# EAGLE design blink1_trinket0 (EAGLE 9.4.2)
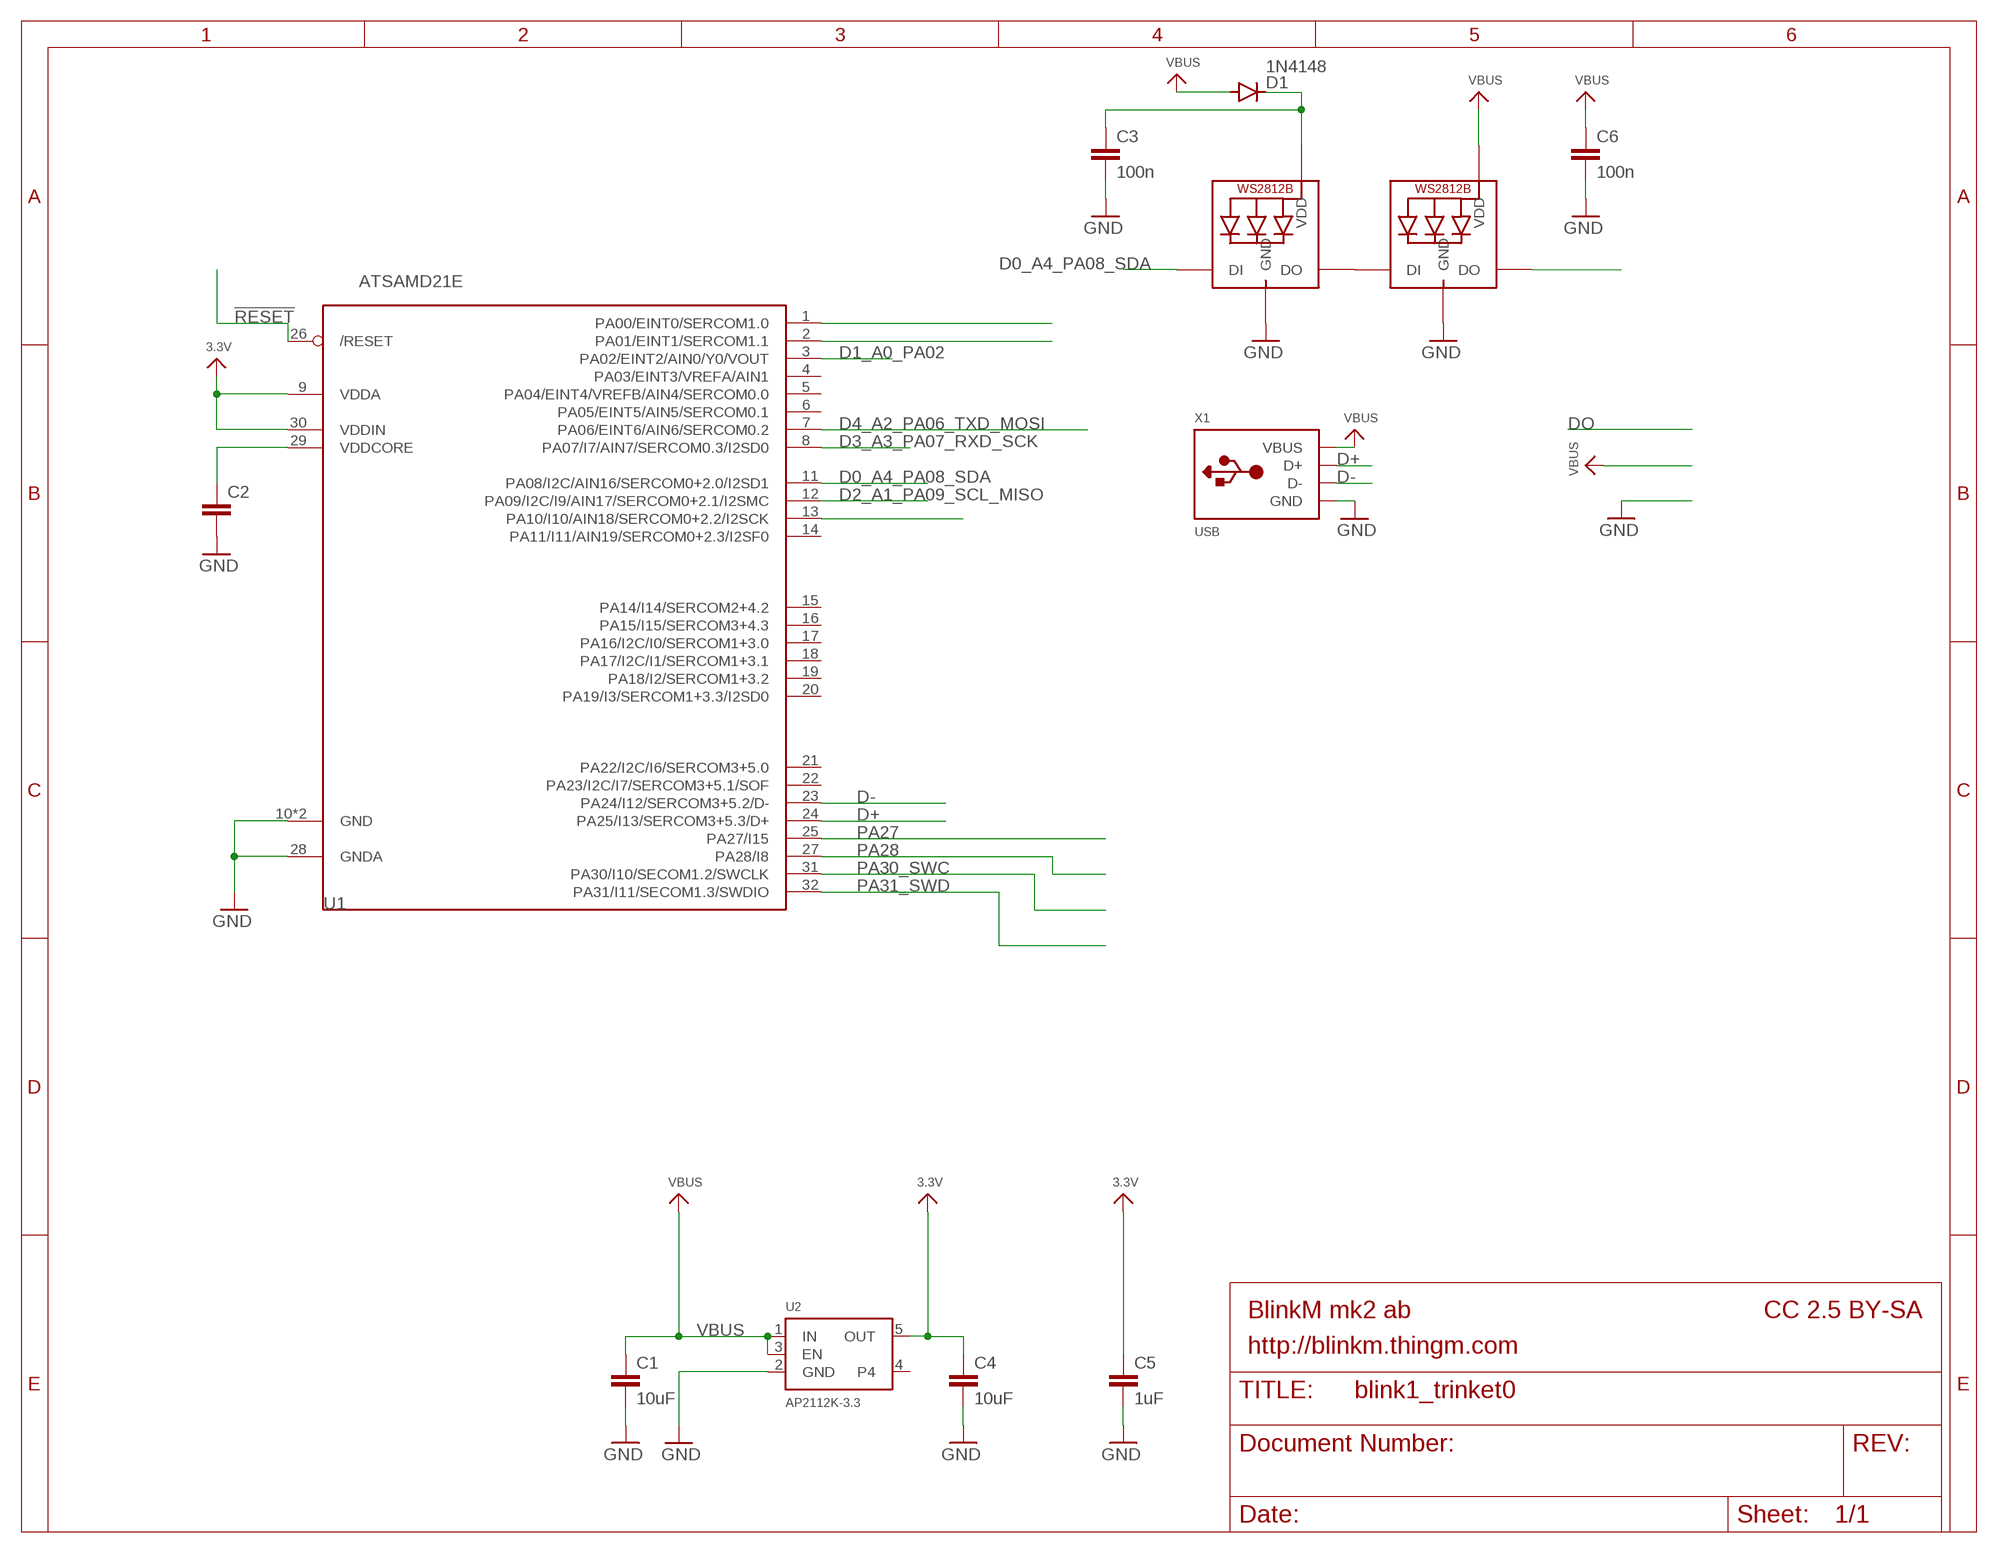
[diagram p0: schematic, sheet 1]

## Parts
C1  10uF  C-EUC0402  [C0402]
C2  C-EUC0402  [C0402]
C3  100n  C-EUC0402  [C0402]
C4  10uF  C-EUC0402  [C0402]
C5  1uF  C-EUC0402  [C0402]
C6  100n  C-EUC0402  [C0402]
D1  1N4148  DIODE-SOD523  [SOD523]
L1  WS2812B3535  [LED3535]
L2  WS2812B3535  [LED3535]
U1  ATSAMD21E  [QFN32_5MM]
U2  AP2112K-3.3  VREG_SOT23-5  [SOT23-5]
X1  USB  [MOLEX-48037-1000]

## Nets
3.3V: C4.1 C5.1 U1.9(VDDA) U1.30(VDDIN) U2.5(OUT)
!RESET: U1.26(/RESET)
A3: U1.1(PA00/EINT0/SERCOM1.0)
D0_A4_PA08_SDA: L1.1(DI) U1.11(PA08/I2C/AIN16/SERCOM0+2.0/I2SD1)
D1_A0_PA02: U1.3(PA02/EINT2/AIN0/Y0/VOUT)
D2_A1_PA09_SCL_MISO: U1.12(PA09/I2C/I9/AIN17/SERCOM0+2.1/I2SMC)
D3_A3_PA07_RXD_SCK: U1.8(PA07/I7/AIN7/SERCOM0.3/I2SD0)
D4_A2_PA06_TXD_MOSI: U1.7(PA06/EINT6/AIN6/SERCOM0.2)
D+: U1.24(PA25/I13/SERCOM3+5.3/D+) X1.3(D+)
D-: U1.23(PA24/I12/SERCOM3+5.2/D-) X1.2(D-)
DO: L2.3(DO)
GND: C1.2 C2.2 C3.2 C4.2 C5.2 C6.2 L1.4(GND) L2.4(GND) U1.10(GND) U1.28(GNDA) U1.33(GND) U2.2(GND) X1.4(GND)
N$1: C3.1 D1.C L1.2(VDD)
N$2: U1.13(PA10/I10/AIN18/SERCOM0+2.2/I2SCK)
N$3: L1.3(DO) L2.1(DI)
N$8: U1.2(PA01/EINT1/SERCOM1.1)
PA27: U1.25(PA27/I15)
PA28: U1.27(PA28/I8)
PA30_SWC: U1.31(PA30/I10/SECOM1.2/SWCLK)
PA31_SWD: U1.32(PA31/I11/SECOM1.3/SWDIO)
VBUS: C1.1 C6.1 D1.A L2.2(VDD) U2.1(IN) U2.3(EN) X1.1(VBUS)
VDDCORE: C2.1 U1.29(VDDCORE)
Unconnected: U1.4(PA03/EINT3/VREFA/AIN1) U1.5(PA04/EINT4/VREFB/AIN4/SERCOM0.0) U1.6(PA05/EINT5/AIN5/SERCOM0.1) U1.14(PA11/I11/AIN19/SERCOM0+2.3/I2SF0) U1.15(PA14/I14/SERCOM2+4.2) U1.16(PA15/I15/SERCOM3+4.3) U1.17(PA16/I2C/I0/SERCOM1+3.0) U1.18(PA17/I2C/I1/SERCOM1+3.1) U1.19(PA18/I2/SERCOM1+3.2) U1.20(PA19/I3/SERCOM1+3.3/I2SD0) U1.21(PA22/I2C/I6/SERCOM3+5.0) U1.22(PA23/I2C/I7/SERCOM3+5.1/SOF) U2.4

## Notes on the sheet
- BlinkM mk2 ab | CC 2.5 BY-SA
- http://blinkm.thingm.com

## Library data of the parts
C1-C6 = rcl:C-EU: CAPACITOR, European symbol; SPICEPREFIX: C
D1 = diode:DIODE-: DIODE
L1 L2 = todstuff:WS2812B
U1 = microbuilder:ATSAMD21E
U2 = microbuilder:VREG_SOT23-5: SOT23-5 Fixed Voltage Regulators Part Current Out V Out V In V Dropout θJA (°C/W) TJ (°C) Digikey Part No. ADP121 150mA 3.3V 3.4-5.5V 0.09V @ 150mA -- -- ADP121-AUJZ33R7CT-ND ADP121 150mA 3.0V 3.1-5.5V 0.09V @ 150mA -- -- ADP121-AUJZ30R7CT-ND ADP122 300mA 3.3V 3.4-5.5V 0.085V @ 300mA -- -- ADP122AUJZ-3.3-R7CT-ND ADP1712 300mA 3.3V 3.5-5.5V 0.17V @ 300mA -- -- ADP1712AUJZ-3.3-R7TR-ND AP7311 (Low Cost) 150mA 3.3V 3.5-6V 0.15V @ 150mA -- -- AP7311-33WG-7DICT-ND LD39015M18R 150mA 1.8V 1.9V-5.5V 0.08V @ 100mA -- -- 497-6977-1-ND LP2985A-33DBVR 150mA 3.3V 3.3-16V 0.28V @ 150mA 206 150 296-18479-1-ND MCP1824T-3302E/OT 300mA 3.3V 3.5V-6V 0.2V @ 300mA -- -- MCP1824T-3302E/OTCT-ND MIC5205-2.5YM5 TR 150mA 2.5V 2.7-16V 0.165V @ 150mA -- -- 576-1257-2-ND MIC5205-3.0YM5 TR 150mA 3.0V 3.2V-16V 0.165V @ 150mA -- -- 576-1258-2-ND MIC5205-3.3YM5 TR 150mA 3.3V 3.5V-16V 0.165V @ 150mA -- -- 576-1259-2-ND TPS780330220 150mA 3.3V+2.2V 3.6-5.5V 250mV Max -- -- 296-23332-1-ND TDA3663/N1,135 100mA 3.3V 3.5-45V 0.18V @ 50mA -- -- 568-5343-1-ND Max operating temp can be calculated using θJA, TJ (max junction temperature), and power in watts. Set the "Maximum Ambient Temperature" until it reaches TJ ("Max Junction Temperature"), which is the absolute limit for safe use of the regulator: Heat Sink Temperature Calculator <http://www.daycounter.com/Calculators/Heat-Sink-Temperature-Calculator.phtml> For example, With 12V source into a 3.3V LP2985 and a 30mA load, we are dissipating (12V-3.3V) * 0.03A = 0.261W. With a θJA of 206 °C/W, a TJ of 150°C, and 261mW we can safely use the chip without a heat sink up to 75°C (=147.1°C Junction Temperature).
X1 = todstuff:USB

## Board
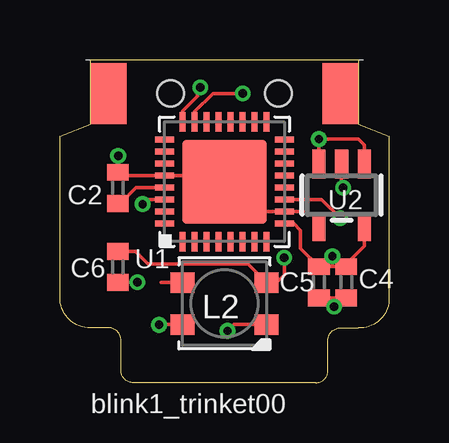
[diagram p1: board, top side]
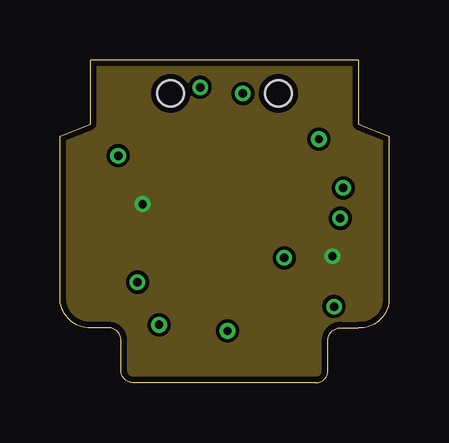
[diagram p2: board, inner layer Route2]
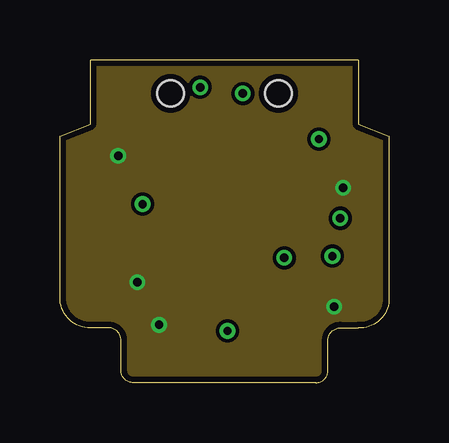
[diagram p3: board, inner layer Route15]
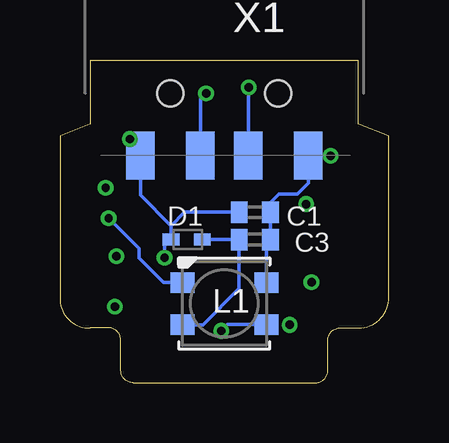
[diagram p4: board, bottom side, seen from below]

Size 13.72 x 13.46 mm. Coordinates in mm from the lower left corner, seen from the top.
Outline: 12.45,13.46 12.45,10.79 13.72,10.29 13.72,3.43 arc-90 12.45,2.29 11.69,2.29 arc90 11.18,1.78 11.18,0.51 arc-90 10.67,0 3.05,0 arc-90 2.55,0.51 2.55,1.78 arc90 2.04,2.29 1.15,2.29 arc-90 0.01,3.68 0.01,10.29 1.28,10.79 1.28,13.46 12.45,13.46
Copper layers (1+2*15+16): Top 0.035mm / dielectric 0.785mm / Route2 0.0175mm / dielectric 1.1mm / Route15 0.0175mm / dielectric 0.2mm / Bottom 0.035mm
Design rules "SeeedStudio_2layer_DRU_no_angle_20140221_blink1thin *": minimum track width 6mil, minimum drill 12mil, track to track 6mil, track to pad 6mil, pad to pad 6mil, via to via 6mil, smd to smd 0mil, copper to edge 10mil, drill to drill 10mil, minimum pad ring 10mil, minimum via ring 6mil, stop-mask expansion 2mil, vias tented up to drill 100mil, thermal gap 10mil

### Footprints (pad centres in the part's own frame; a part is rotated, then mirrored left to right if it is on the bottom)
C0402 = smd 0.7 x 0.9: 1 -0.65,0; 2 0.65,0
SOD523 = smd 0.7 x 0.5: A 0.7,0; C -0.6,0
LED3535 = smd 1 x 0.85: 1 -1.75,0.875; 2 -1.75,-0.875; 3 1.75,-0.875; 4 1.75,0.875
QFN32_5MM = smd 0.8 x 0.25: 1 -2.5,1.75; 2 -2.5,1.25; 3 -2.5,0.75; 4 -2.5,0.25; 5 -2.5,-0.25; 6 -2.5,-0.75; 7 -2.5,-1.25; 8 -2.5,-1.75; 17 2.5,-1.75; 18 2.5,-1.25; 19 2.5,-0.75; 20 2.5,-0.25; 21 2.5,0.25; 22 2.5,0.75; 23 2.5,1.25; 24 2.5,1.75 | smd 0.25 x 0.8: 9 -1.75,-2.5; 10 -1.25,-2.5; 11 -0.75,-2.5; 12 -0.25,-2.5; 13 0.25,-2.5; 14 0.75,-2.5; 15 1.25,-2.5; 16 1.75,-2.5; 25 1.75,2.5; 26 1.25,2.5; 27 0.75,2.5; 28 0.25,2.5; 29 -0.25,2.5; 30 -0.75,2.5; 31 -1.25,2.5; 32 -1.75,2.5 | smd 3.5 x 3.5: 33 0,0
SOT23-5 = smd 0.55 x 1.2: 1 -0.95,-1.3; 2 0,-1.3; 3 0.95,-1.3; 4 0.95,1.3; 5 -0.95,1.3
MOLEX-48037-1000 = smd 2 x 1.2: 1 2.6,-3.5; 2 2.6,-1; 3 2.6,1; 4 2.6,3.5 | smd 2.54 x 1.524 bottom: P$1 0,4.85; P$2 0,-4.85 | hole 1.1: 0,2.25; 0,-2.25

### Placement (x,y rotation side)
C1  5.59,7.11 0 bottom
C2  2.42,8.13 90 top
C3  5.59,5.97 0 bottom
C4  11.94,4.19 270 top
C5  10.8,4.19 270 top
C6  2.42,4.83 270 top
D1  8.39,5.97 180 bottom
L1  6.86,3.3 0 bottom
L2  6.86,3.3 180 top
U1  6.86,8.38 90 top
U2  11.75,7.82 180 top
X1  6.86,12.07 270 bottom

### Tracks (layer width: path | path; a pad name or v marks a point on that pad's centre or on a via)
3.3V  (via drill 0.35)
  Top 0.152: U1.30 3.57,7.63 3.45,7.5 | 3.45,7.5 3.44,7.49 | 3.45,7.5 v3.45,7.45 | U1.9 9.76,6.63 10.04,6.35 10.04,5.61 C5.1 | C5.1 11.07,4.84 | U2.5 12.7,5.71 11.94,4.95 C4.1 11.44,4.84 | C5.1 11.44,4.84 | 11.44,4.84 11.36,4.91 v11.36,5.28
  pour Route2: 13.85,13.46 0.01,13.46 0.01,0.01 13.85,0
D0_A4_PA08_SDA  (via drill 0.35)
  Top 0.152: U1.11 10.92,7.63 v11.69,6.86
  Bottom 0.152: L1.1 9.39,4.18 10.42,5.21 10.42,5.59 v11.69,6.86
D+  (via drill 0.35)
  Top 0.152: v5.85,12.32 5.75,12.22 5.75,11.95 5.11,11.32 U1.24
  Bottom 0.152: v5.85,12.32 5.85,9.48 X1.3
D-  (via drill 0.35)
  Top 0.152: U1.23 5.61,11.3 6.38,12.07 v7.63,12.07
  Bottom 0.152: v7.63,12.07 7.86,11.83 X1.2
DO
  Top 0.152: L2.3 4.21,4.18
GND  (via drill 0.35)
  Top 0.152: v2.43,9.46 2.42,9.45 C2.2 2.57,8.63 U1.28 6.61,8.63 U1.33 8.11,7.13 U1.10 10.15,7.13 | U2.2 11.75,8.2 v11.82,8.13 | C6.2 2.43,4.19 v3.23,4.19 | C4.2 11.44,3.54 | 11.44,3.54 C5.2 | v11.44,3.17 11.44,3.54 | L2.4 4.15,2.43 v4.13,2.41
  Bottom 0.152: v2.43,9.46 X1.4 3.36,8.33 3.82,7.87 4.58,7.87 4.94,7.51 C1.2 C3.2 5.11,5.8 L1.4
  pour Route15: 0.01,13.46 13.72,13.46 13.72,-0.38 0.01,-0.38
N$1
  Bottom 0.152: D1.C C3.1 6.24,3.92 7.75,2.41 8.6,2.41 L1.2
N$3  (via drill 0.35)
  Top 0.152: v6.99,2.16 7.26,2.43 L2.1
  Bottom 0.152: L1.3 6.72,2.43 v6.99,2.16
VBUS  (via drill 0.35)
  Top 0.152: U2.3 v10.8,10.16 12.45,10.16 12.7,9.91 U2.1 | C6.1 3.17,5.48 3.68,4.96 7.83,4.96 L2.2 9.04,4.18 9.36,4.49 v9.36,5.21
  Bottom 0.152: 9.09,6.54 D1.A 9.36,5.7 v9.36,5.21 | X1.1 10.36,9.4 | 10.36,9.4 10.36,7.82 9.09,6.54 | v10.8,10.16 10.8,9.84 10.36,9.4 | C1.1 8.52,7.11 9.09,6.54
VDDCORE
  Top 0.152: U1.29 3.19,8.13 2.53,7.48 C2.1

### Text on the board
tPlace: blink1_trinket00